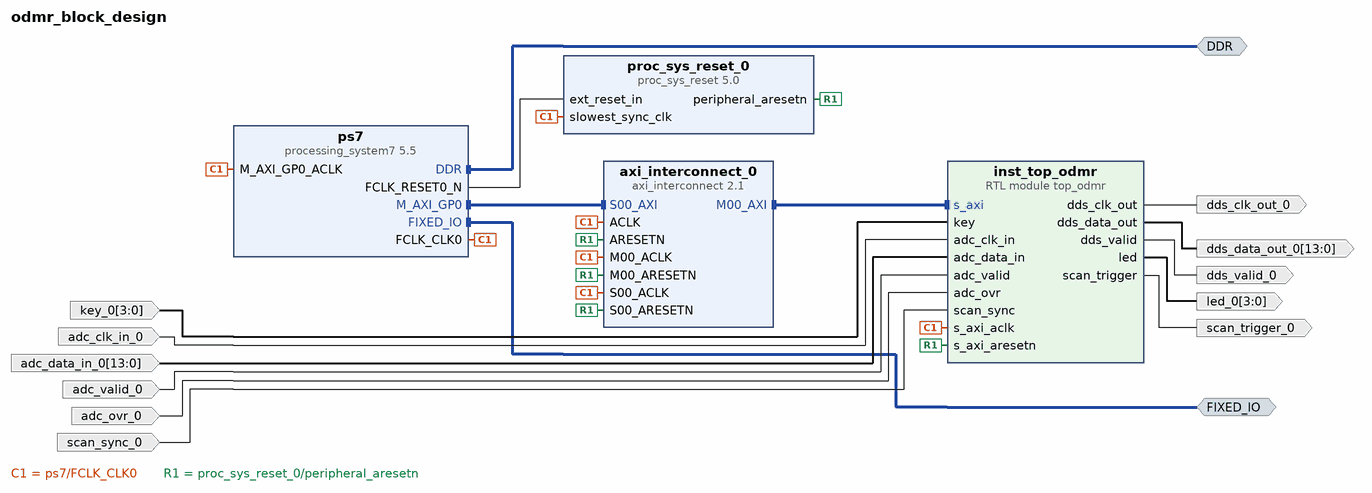
[diagram p0: block diagram of the top level]
# Vivado block design odmr_block_design, xc7z020clg400-2, Vivado 2020.2
create_bd_design odmr_block_design

create_bd_intf_port -mode Master -vlnv xilinx.com:interface:ddrx_rtl:1.0 DDR
create_bd_intf_port -mode Master -vlnv xilinx.com:display_processing_system7:fixedio_rtl:1.0 FIXED_IO
create_bd_port -dir O -from 3 -to 0 led_0
create_bd_port -dir I -from 3 -to 0 key_0
create_bd_port -dir O dds_clk_out_0
create_bd_port -dir O -from 13 -to 0 dds_data_out_0
create_bd_port -dir O dds_valid_0
create_bd_port -dir I adc_clk_in_0
create_bd_port -dir I -from 13 -to 0 adc_data_in_0
create_bd_port -dir I adc_valid_0
create_bd_port -dir I adc_ovr_0
create_bd_port -dir I scan_sync_0
create_bd_port -dir O scan_trigger_0

create_bd_cell -type ip -vlnv xilinx.com:ip:processing_system7:5.5 ps7
set_property -dict {CONFIG.PCW_FPGA0_PERIPHERAL_FREQMHZ 50} [get_bd_cells ps7]
# 31 more settings of ps7 are not shown: defaults, MIO pin electricals, DDR timing, and values the tool derives
create_bd_cell -type ip -vlnv xilinx.com:ip:axi_interconnect:2.1 axi_interconnect_0
set_property -dict {CONFIG.NUM_MI 1 CONFIG.NUM_SI 1} [get_bd_cells axi_interconnect_0]
create_bd_cell -type ip -vlnv xilinx.com:ip:proc_sys_reset:5.0 proc_sys_reset_0
create_bd_cell -type module -reference top_odmr inst_top_odmr

# ---- connections ----

connect_bd_intf_net [get_bd_intf_ports DDR] [get_bd_intf_pins ps7/DDR]
connect_bd_intf_net [get_bd_intf_pins ps7/M_AXI_GP0] [get_bd_intf_pins axi_interconnect_0/S00_AXI]
connect_bd_intf_net [get_bd_intf_pins axi_interconnect_0/M00_AXI] [get_bd_intf_pins inst_top_odmr/s_axi]
connect_bd_intf_net [get_bd_intf_ports FIXED_IO] [get_bd_intf_pins ps7/FIXED_IO]
connect_bd_net [get_bd_pins ps7/FCLK_CLK0] \
  [get_bd_pins ps7/M_AXI_GP0_ACLK] [get_bd_pins proc_sys_reset_0/slowest_sync_clk] [get_bd_pins inst_top_odmr/s_axi_aclk] \
  [get_bd_pins axi_interconnect_0/ACLK] [get_bd_pins axi_interconnect_0/S00_ACLK] [get_bd_pins axi_interconnect_0/M00_ACLK]
connect_bd_net [get_bd_pins ps7/FCLK_RESET0_N] [get_bd_pins proc_sys_reset_0/ext_reset_in]
connect_bd_net [get_bd_pins proc_sys_reset_0/peripheral_aresetn] \
  [get_bd_pins inst_top_odmr/s_axi_aresetn] [get_bd_pins axi_interconnect_0/ARESETN] \
  [get_bd_pins axi_interconnect_0/S00_ARESETN] [get_bd_pins axi_interconnect_0/M00_ARESETN]
connect_bd_net [get_bd_pins inst_top_odmr/led] [get_bd_ports led_0]
connect_bd_net -net key_0_1 [get_bd_ports key_0] [get_bd_pins inst_top_odmr/key]
connect_bd_net [get_bd_pins inst_top_odmr/dds_clk_out] [get_bd_ports dds_clk_out_0]
connect_bd_net [get_bd_pins inst_top_odmr/dds_data_out] [get_bd_ports dds_data_out_0]
connect_bd_net [get_bd_pins inst_top_odmr/dds_valid] [get_bd_ports dds_valid_0]
connect_bd_net -net adc_clk_in_0_1 [get_bd_ports adc_clk_in_0] [get_bd_pins inst_top_odmr/adc_clk_in]
connect_bd_net -net adc_data_in_0_1 [get_bd_ports adc_data_in_0] [get_bd_pins inst_top_odmr/adc_data_in]
connect_bd_net -net adc_valid_0_1 [get_bd_ports adc_valid_0] [get_bd_pins inst_top_odmr/adc_valid]
connect_bd_net -net adc_ovr_0_1 [get_bd_ports adc_ovr_0] [get_bd_pins inst_top_odmr/adc_ovr]
connect_bd_net -net scan_sync_0_1 [get_bd_ports scan_sync_0] [get_bd_pins inst_top_odmr/scan_sync]
connect_bd_net [get_bd_pins inst_top_odmr/scan_trigger] [get_bd_ports scan_trigger_0]

# ---- address map ----
assign_bd_address -offset 0x43C00000 -range 64K -target_address_space [get_bd_addr_spaces ps7/Data] [get_bd_addr_segs inst_top_odmr/s_axi/reg0]

validate_bd_design
save_bd_design
